# EAGLE design cblock-vrs (EAGLE 6.6.0)
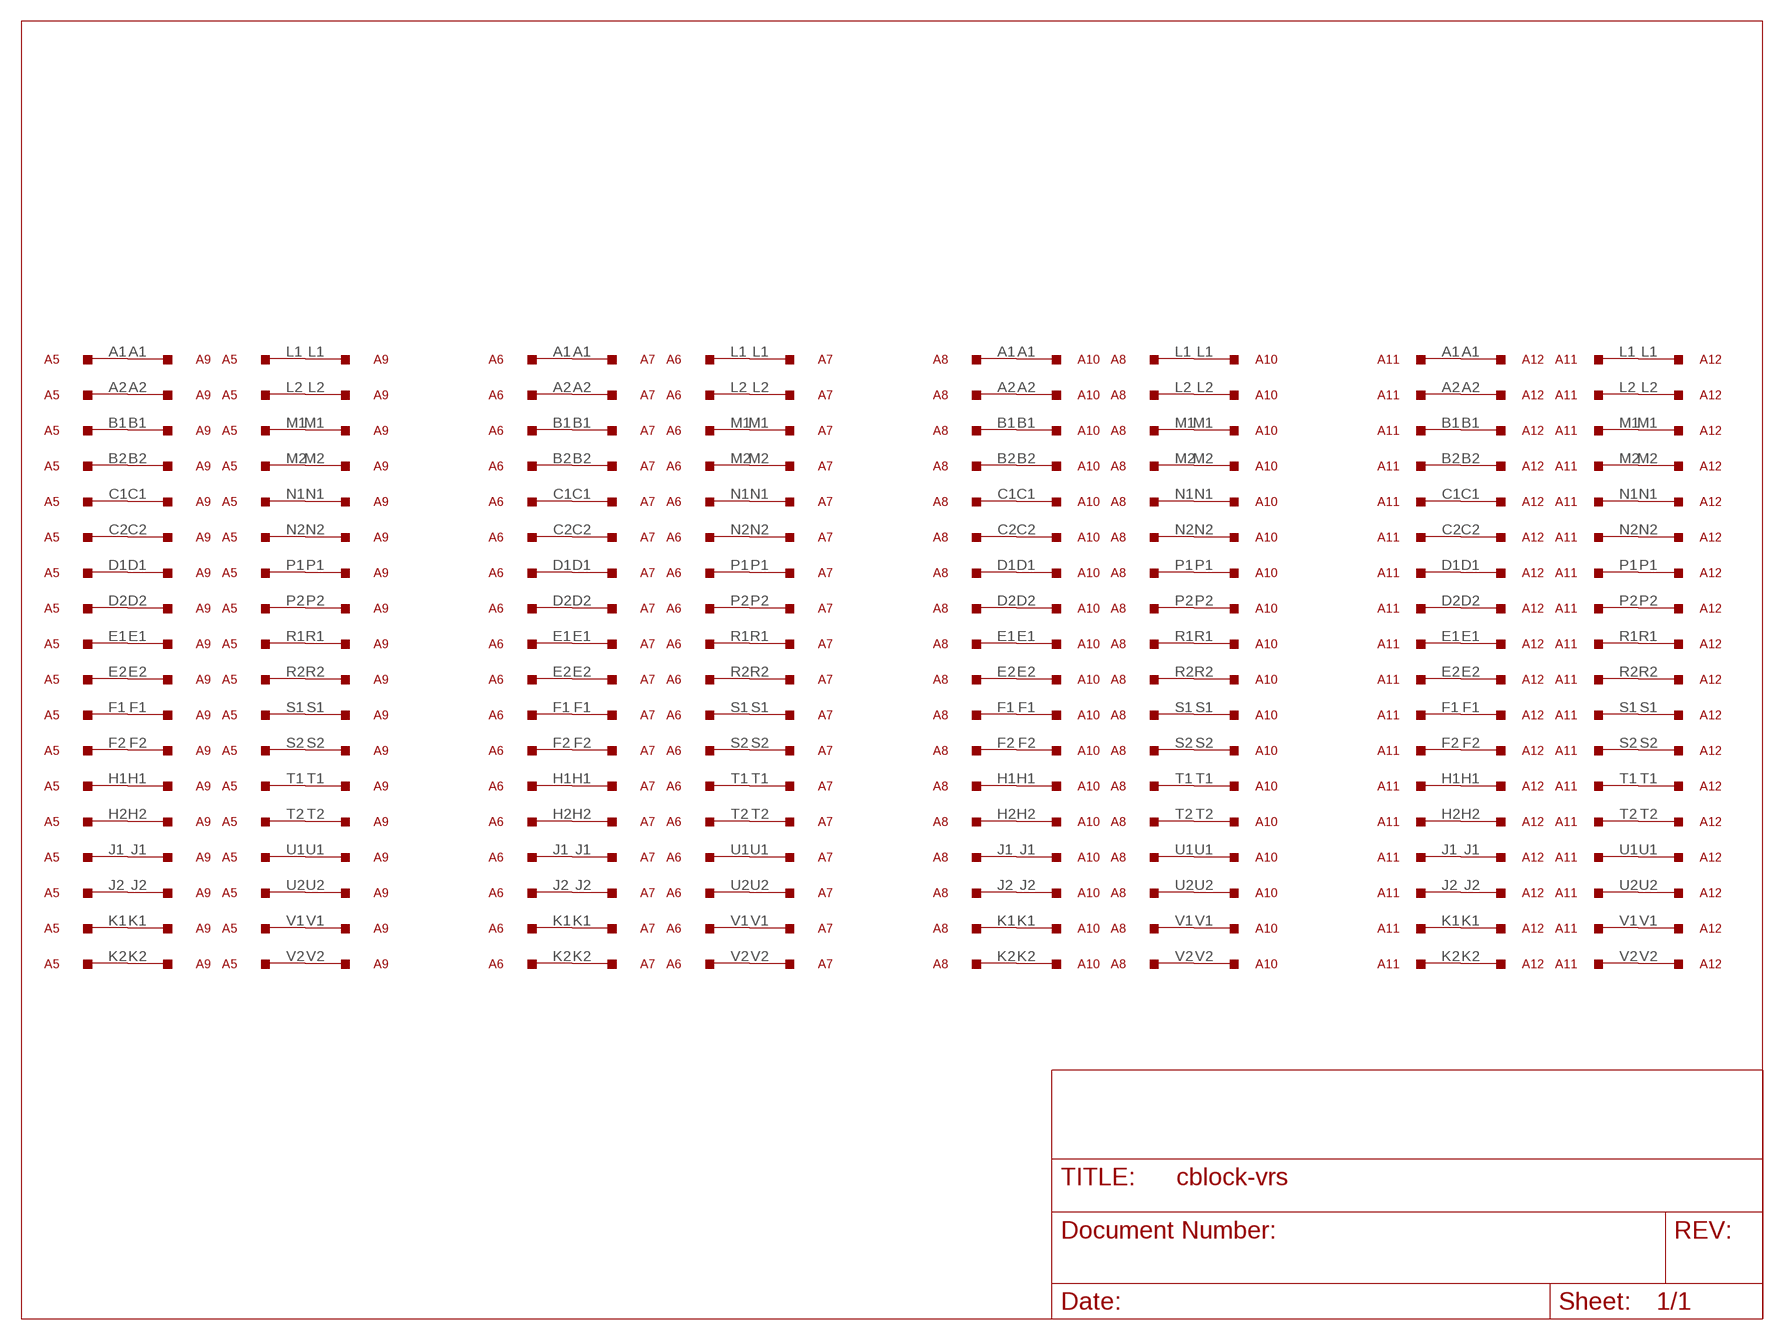
[diagram p0: schematic, sheet 1]

## Parts
A5  M916  [H807]
A6  M916  [H807]
A7  M916  [H807]
A8  M916  [H807]
A9  M916  [H807]
A10  M916  [H807]
A11  M916  [H807]
A12  M916  [H807]

## Nets
N$26: A5.L1 A9.L1
N$33: A5.L2 A9.L2
N$34: A5.M1 A9.M1
N$35: A5.M2 A9.M2
N$36: A5.N1 A9.N1
N$49: A5.N2 A9.N2
N$50: A5.P1 A9.P1
N$51: A5.P2 A9.P2
N$52: A5.R1 A9.R1
N$69: A5.R2 A9.R2
N$70: A5.S1 A9.S1
N$71: A5.S2 A9.S2
N$72: A5.T1 A9.T1
N$73: A5.T2 A9.T2
N$74: A5.U1 A9.U1
N$75: A5.U2 A9.U2
N$76: A5.V1 A9.V1
N$81: A5.V2 A9.V2
N$82: A5.A1 A9.A1
N$83: A5.A2 A9.A2
N$84: A5.B1 A9.B1
N$85: A5.B2 A9.B2
N$86: A5.C1 A9.C1
N$87: A5.C2 A9.C2
N$88: A5.D1 A9.D1
N$89: A5.D2 A9.D2
N$90: A5.E1 A9.E1
N$91: A5.E2 A9.E2
N$92: A5.F1 A9.F1
N$93: A5.F2 A9.F2
N$95: A5.H1 A9.H1
N$96: A5.H2 A9.H2
N$97: A5.J1 A9.J1
N$98: A5.J2 A9.J2
N$99: A5.K1 A9.K1
N$100: A5.K2 A9.K2
N$113: A6.L1 A7.L1
N$114: A6.L2 A7.L2
N$115: A6.M1 A7.M1
N$116: A6.M2 A7.M2
N$117: A6.N1 A7.N1
N$118: A6.N2 A7.N2
N$119: A6.P1 A7.P1
N$120: A6.P2 A7.P2
N$121: A6.R1 A7.R1
N$122: A6.R2 A7.R2
N$123: A6.S1 A7.S1
N$137: A6.S2 A7.S2
N$186: A6.T1 A7.T1
N$187: A6.T2 A7.T2
N$188: A6.U1 A7.U1
N$189: A6.U2 A7.U2
N$190: A6.V1 A7.V1
N$191: A6.V2 A7.V2
N$192: A6.A1 A7.A1
N$193: A6.A2 A7.A2
N$194: A6.B1 A7.B1
N$195: A6.B2 A7.B2
N$196: A6.C1 A7.C1
N$197: A6.C2 A7.C2
N$198: A6.D1 A7.D1
N$199: A6.D2 A7.D2
N$200: A6.E1 A7.E1
N$201: A6.E2 A7.E2
N$202: A6.F1 A7.F1
N$203: A6.F2 A7.F2
N$204: A6.H1 A7.H1
N$205: A6.H2 A7.H2
N$206: A6.J1 A7.J1
N$207: A6.J2 A7.J2
N$208: A6.K1 A7.K1
N$209: A6.K2 A7.K2
N$210: A8.L1 A10.L1
N$211: A8.L2 A10.L2
N$212: A8.M1 A10.M1
N$213: A8.M2 A10.M2
N$214: A8.N1 A10.N1
N$215: A8.N2 A10.N2
N$216: A8.P1 A10.P1
N$217: A8.P2 A10.P2
N$218: A8.R1 A10.R1
N$219: A8.R2 A10.R2
N$220: A8.S1 A10.S1
N$221: A8.S2 A10.S2
N$222: A8.T1 A10.T1
N$223: A8.T2 A10.T2
N$224: A8.U1 A10.U1
N$225: A8.U2 A10.U2
N$226: A8.V1 A10.V1
N$227: A8.V2 A10.V2
N$228: A8.A1 A10.A1
N$229: A8.A2 A10.A2
N$230: A8.B1 A10.B1
N$231: A8.B2 A10.B2
N$232: A8.C1 A10.C1
N$233: A8.C2 A10.C2
N$234: A8.D1 A10.D1
N$235: A8.D2 A10.D2
N$236: A8.E1 A10.E1
N$237: A8.E2 A10.E2
N$238: A8.F1 A10.F1
N$239: A8.F2 A10.F2
N$240: A8.H1 A10.H1
N$241: A8.H2 A10.H2
N$242: A8.J1 A10.J1
N$243: A8.J2 A10.J2
N$244: A8.K1 A10.K1
N$245: A8.K2 A10.K2
N$246: A11.L1 A12.L1
N$247: A11.L2 A12.L2
N$248: A11.M1 A12.M1
N$249: A11.M2 A12.M2
N$250: A11.N1 A12.N1
N$251: A11.N2 A12.N2
N$252: A11.P1 A12.P1
N$253: A11.P2 A12.P2
N$254: A11.R1 A12.R1
N$255: A11.R2 A12.R2
N$256: A11.S1 A12.S1
N$257: A11.S2 A12.S2
N$258: A11.T1 A12.T1
N$259: A11.T2 A12.T2
N$260: A11.U1 A12.U1
N$261: A11.U2 A12.U2
N$262: A11.V1 A12.V1
N$263: A11.V2 A12.V2
N$264: A11.A1 A12.A1
N$265: A11.A2 A12.A2
N$266: A11.B1 A12.B1
N$267: A11.B2 A12.B2
N$268: A11.C1 A12.C1
N$269: A11.C2 A12.C2
N$270: A11.D1 A12.D1
N$271: A11.D2 A12.D2
N$272: A11.E1 A12.E1
N$273: A11.E2 A12.E2
N$274: A11.F1 A12.F1
N$275: A11.F2 A12.F2
N$276: A11.H1 A12.H1
N$277: A11.H2 A12.H2
N$278: A11.J1 A12.J1
N$279: A11.J2 A12.J2
N$280: A11.K1 A12.K1
N$281: A11.K2 A12.K2

## Library data of the parts
A5-A12 = dec-m:M916: Simple 36 pin connector/wire cable

## Net classes
1 Power: width 0.305 mm, clearance 0.305 mm

## Board
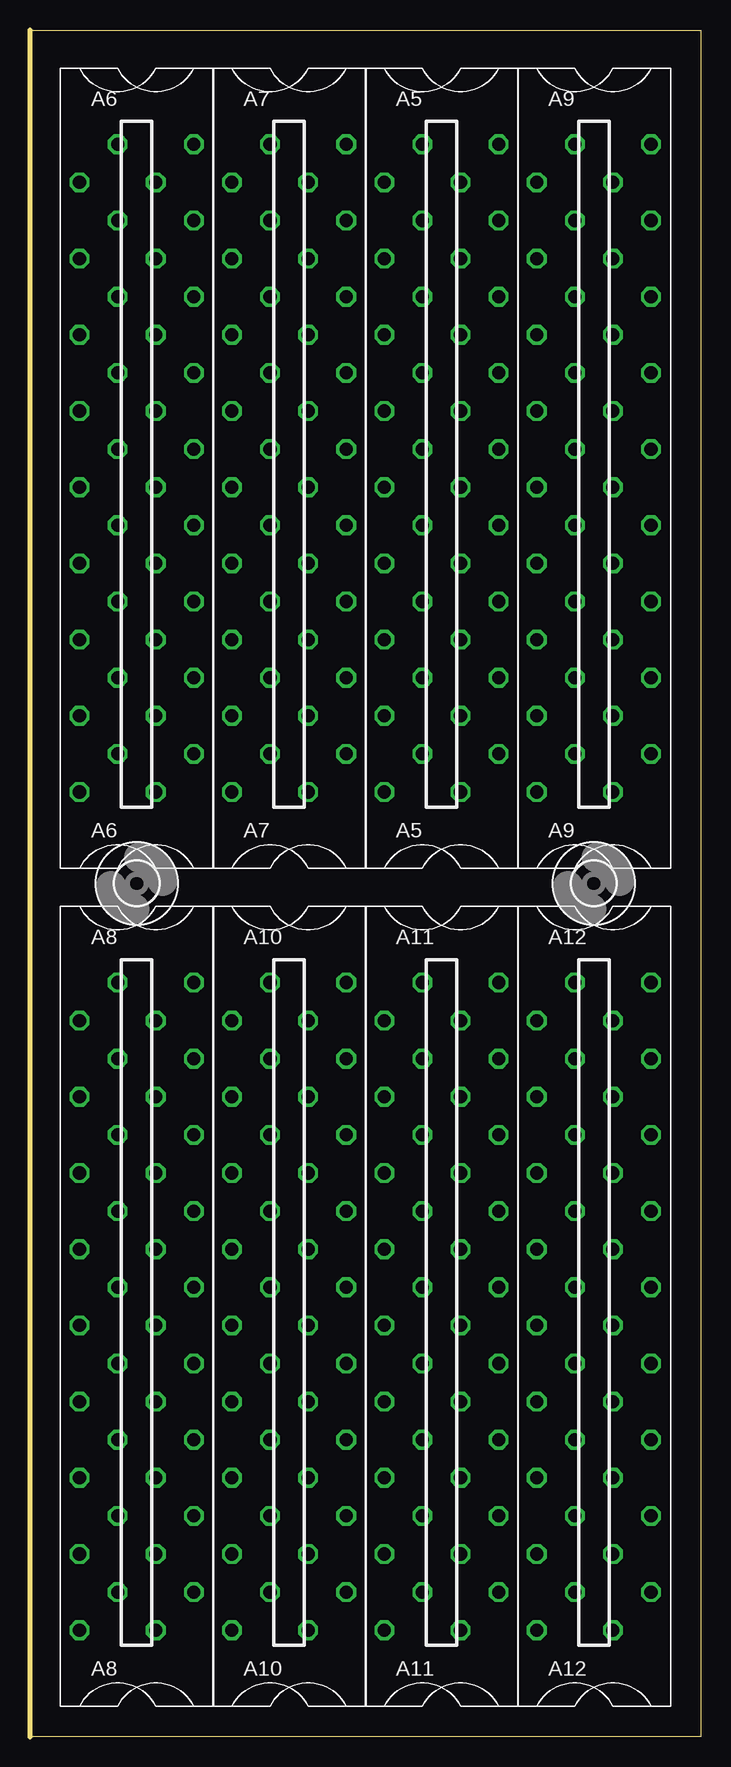
[diagram p1: board, top side]
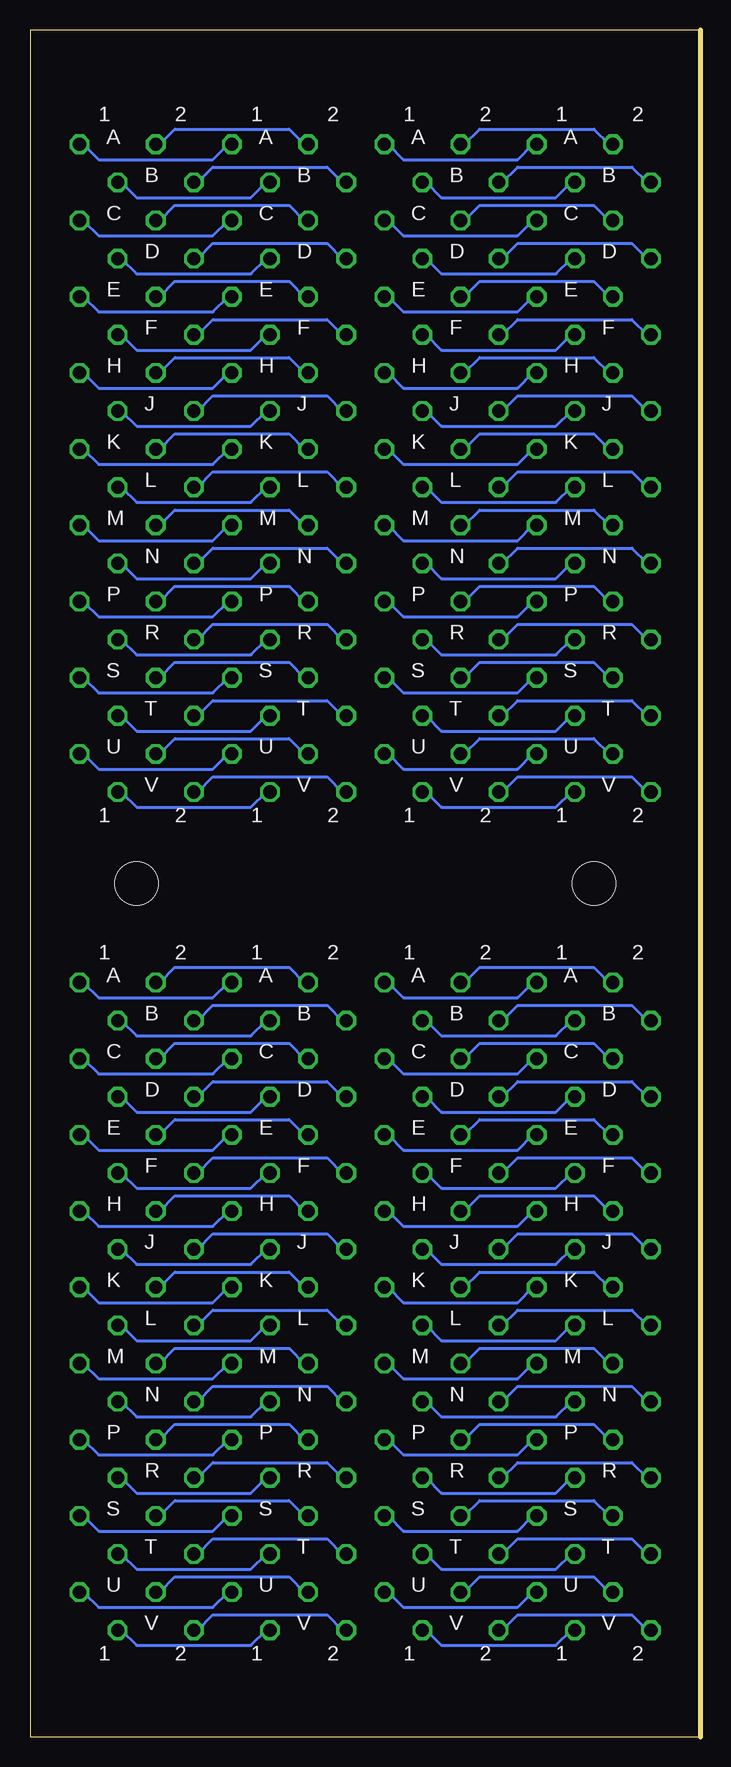
[diagram p2: board, bottom side, seen from below]

Size 55.88 x 142.24 mm. Coordinates in mm from the lower left corner, seen from the top.
Outline: 55.88,0 0,0 0,142.24 55.88,142.24 55.88,0
Copper layers (1*16): Top 0.035mm / dielectric 1.5mm / Bottom 0.035mm
Design rules "olimex10mil": minimum track width 10mil, minimum drill 24mil, track to track 10mil, track to pad 10mil, pad to pad 10mil, via to via 10mil, smd to smd 10mil, copper to edge 40mil, drill to drill 10mil, minimum pad ring 10mil, minimum via ring 8mil, stop-mask expansion 0mil, vias tented up to drill 0mil, thermal gap 10mil

### Footprints (pad centres in the part's own frame; a part is rotated, then mirrored left to right if it is on the bottom)
H807 = drill 1.092 octagon: A1 4.763,28.575; A2 -1.587,28.575; B1 1.587,25.4; B2 -4.763,25.4; C1 4.763,22.225; C2 -1.587,22.225; D1 1.587,19.05; D2 -4.763,19.05; E1 4.763,15.875; E2 -1.587,15.875; F1 1.587,12.7; F2 -4.763,12.7; H1 4.763,9.525; H2 -1.587,9.525; J1 1.587,6.35; J2 -4.763,6.35; K1 4.763,3.175; K2 -1.587,3.175; L1 1.587,0; L2 -4.763,0; M1 4.763,-3.175; M2 -1.587,-3.175; N1 1.587,-6.35; N2 -4.763,-6.35; P1 4.763,-9.525; P2 -1.587,-9.525; R1 1.587,-12.7; R2 -4.763,-12.7; S1 4.763,-15.875; S2 -1.587,-15.875; T1 1.587,-19.05; T2 -4.763,-19.05; U1 4.763,-22.225; U2 -1.587,-22.225; V1 1.587,-25.4; V2 -4.763,-25.4
3,6 = hole 3.6: 0,0

### Placement (x,y rotation side)
A5  34.29,104.14 0 top
A6  8.89,104.14 0 top
A7  21.59,104.14 0 top
A8  8.89,34.29 0 top
A9  46.99,104.14 0 top
A10  21.59,34.29 0 top
A11  34.29,34.29 0 top
A12  46.99,34.29 0 top
U$5  [3,6]  8.89,71.12 0 top
U$6  [3,6]  46.99,71.12 0 top

### Tracks (layer width: path | path; a pad name or v marks a point on that pad's centre or on a via)
N$26
  Bottom 0.254: A5.L1 36.2,104.14 37.47,102.87 46.99,102.87 48.26,104.14 A9.L1
N$33
  Bottom 0.254: A5.L2 29.84,104.14 31.11,105.41 40.64,105.41 41.91,104.14 A9.L2
N$34
  Bottom 0.254: A5.M1 39.37,100.97 40.64,99.69 50.16,99.69 51.44,100.97 A9.M1
N$35
  Bottom 0.254: A5.M2 33.02,100.97 34.29,102.23 43.81,102.23 45.09,100.97 A9.M2
N$36
  Bottom 0.254: A5.N1 36.2,97.79 37.47,96.52 46.99,96.52 48.26,97.79 A9.N1
N$49
  Bottom 0.254: A5.N2 29.84,97.79 31.11,99.06 40.64,99.06 41.91,97.79 A9.N2
N$50
  Bottom 0.254: A5.P1 39.37,94.61 40.64,93.34 50.16,93.34 51.44,94.61 A9.P1
N$51
  Bottom 0.254: A5.P2 33.02,94.61 34.29,95.89 43.81,95.89 45.09,94.61 A9.P2
N$52
  Bottom 0.254: A5.R1 36.2,91.44 37.47,90.17 46.99,90.17 48.26,91.44 A9.R1
N$69
  Bottom 0.254: A5.R2 29.84,91.44 31.11,92.71 40.64,92.71 41.91,91.44 A9.R2
N$70
  Bottom 0.254: A5.S1 39.37,88.27 40.64,87 50.16,87 51.44,88.27 A9.S1
N$71
  Bottom 0.254: A5.S2 33.02,88.27 34.29,89.53 43.81,89.53 45.09,88.27 A9.S2
N$72
  Bottom 0.254: A5.T1 36.2,85.09 37.47,83.82 46.99,83.82 48.26,85.09 A9.T1
N$73
  Bottom 0.254: A5.T2 29.84,85.09 31.11,86.36 40.64,86.36 41.91,85.09 A9.T2
N$74
  Bottom 0.254: A5.U1 39.37,81.92 40.64,80.64 50.16,80.64 51.44,81.92 A9.U1
N$75
  Bottom 0.254: A5.U2 33.02,81.92 34.29,83.19 43.81,83.19 45.09,81.92 A9.U2
N$76
  Bottom 0.254: A5.V1 36.2,78.74 37.47,77.47 46.99,77.47 48.26,78.74 A9.V1
N$81
  Bottom 0.254: A5.V2 29.84,78.74 31.11,80.01 40.64,80.01 41.91,78.74 A9.V2
N$82
  Bottom 0.254: A5.A1 39.37,132.72 40.64,131.44 50.16,131.44 51.44,132.72 A9.A1
N$83
  Bottom 0.254: A5.A2 33.02,132.72 34.29,133.99 43.81,133.99 45.09,132.72 A9.A2
N$84
  Bottom 0.254: A5.B1 36.2,129.54 37.47,128.27 46.99,128.27 48.26,129.54 A9.B1
N$85
  Bottom 0.254: A5.B2 29.84,129.54 31.11,130.81 40.64,130.81 41.91,129.54 A9.B2
N$86
  Bottom 0.254: A5.C1 39.37,126.36 40.64,125.09 50.16,125.09 51.44,126.36 A9.C1
N$87
  Bottom 0.254: A5.C2 33.02,126.36 34.29,127.64 43.81,127.64 45.09,126.36 A9.C2
N$88
  Bottom 0.254: A5.D1 36.2,123.19 37.47,121.92 46.99,121.92 48.26,123.19 A9.D1
N$89
  Bottom 0.254: A5.D2 29.84,123.19 31.11,124.46 40.64,124.46 41.91,123.19 A9.D2
N$90
  Bottom 0.254: A5.E1 39.37,120.02 40.64,118.75 50.16,118.75 51.44,120.02 A9.E1
N$91
  Bottom 0.254: A5.E2 33.02,120.02 34.29,121.28 43.81,121.28 45.09,120.02 A9.E2
N$92
  Bottom 0.254: A5.F1 36.2,116.84 37.47,115.57 46.99,115.57 48.26,116.84 A9.F1
N$93
  Bottom 0.254: A5.F2 29.84,116.84 31.11,118.11 40.64,118.11 41.91,116.84 A9.F2
N$95
  Bottom 0.254: A5.H1 39.37,113.67 40.64,112.39 50.16,112.39 51.44,113.67 A9.H1
N$96
  Bottom 0.254: A5.H2 33.02,113.67 34.29,114.94 43.81,114.94 45.09,113.67 A9.H2
N$97
  Bottom 0.254: A5.J1 36.2,110.49 37.47,109.22 46.99,109.22 48.26,110.49 A9.J1
N$98
  Bottom 0.254: A5.J2 29.84,110.49 31.11,111.76 40.64,111.76 41.91,110.49 A9.J2
N$99
  Bottom 0.254: A5.K1 39.37,107.31 40.64,106.05 50.16,106.05 51.44,107.31 A9.K1
N$100
  Bottom 0.254: A5.K2 33.02,107.31 34.29,108.58 43.81,108.58 45.09,107.31 A9.K2
N$113
  Bottom 0.254: A6.L1 10.79,104.14 12.06,102.87 21.59,102.87 22.86,104.14 A7.L1
N$114
  Bottom 0.254: A6.L2 4.45,104.14 5.71,105.41 15.24,105.41 16.51,104.14 A7.L2
N$115
  Bottom 0.254: A6.M1 13.97,100.97 15.24,99.69 24.77,99.69 26.04,100.97 A7.M1
N$116
  Bottom 0.254: A6.M2 7.62,100.97 8.89,102.23 18.41,102.23 19.68,100.97 A7.M2
N$117
  Bottom 0.254: A6.N1 10.79,97.79 12.06,96.52 21.59,96.52 22.86,97.79 A7.N1
N$118
  Bottom 0.254: A6.N2 4.45,97.79 5.71,99.06 15.24,99.06 16.51,97.79 A7.N2
N$119
  Bottom 0.254: A6.P1 13.97,94.61 15.24,93.34 24.77,93.34 26.04,94.61 A7.P1
N$120
  Bottom 0.254: A6.P2 7.62,94.61 8.89,95.89 18.41,95.89 19.68,94.61 A7.P2
N$121
  Bottom 0.254: A6.R1 10.79,91.44 12.06,90.17 21.59,90.17 22.86,91.44 A7.R1
N$122
  Bottom 0.254: A6.R2 4.45,91.44 5.71,92.71 15.24,92.71 16.51,91.44 A7.R2
N$123
  Bottom 0.254: A6.S1 13.97,88.27 15.24,87 24.77,87 26.04,88.27 A7.S1
N$137
  Bottom 0.254: A6.S2 7.62,88.27 8.89,89.53 18.41,89.53 19.68,88.27 A7.S2
N$186
  Bottom 0.254: A6.T1 10.79,85.09 12.06,83.82 21.59,83.82 22.86,85.09 A7.T1
N$187
  Bottom 0.254: A6.T2 4.45,85.09 5.71,86.36 15.24,86.36 16.51,85.09 A7.T2
N$188
  Bottom 0.254: A6.U1 13.97,81.92 15.24,80.64 24.77,80.64 26.04,81.92 A7.U1
N$189
  Bottom 0.254: A6.U2 7.62,81.92 8.89,83.19 18.41,83.19 19.68,81.92 A7.U2
N$190
  Bottom 0.254: A6.V1 10.79,78.74 12.06,77.47 21.59,77.47 22.86,78.74 A7.V1
N$191
  Bottom 0.254: A6.V2 4.45,78.74 5.71,80.01 15.24,80.01 16.51,78.74 A7.V2
N$192
  Bottom 0.254: A6.A1 13.97,132.72 15.24,131.44 24.77,131.44 26.04,132.72 A7.A1
N$193
  Bottom 0.254: A6.A2 7.62,132.72 8.89,133.99 18.41,133.99 19.68,132.72 A7.A2
N$194
  Bottom 0.254: A6.B1 10.79,129.54 12.06,128.27 21.59,128.27 22.86,129.54 A7.B1
N$195
  Bottom 0.254: A6.B2 4.45,129.54 5.71,130.81 15.24,130.81 16.51,129.54 A7.B2
N$196
  Bottom 0.254: A6.C1 13.97,126.36 15.24,125.09 24.77,125.09 26.04,126.36 A7.C1
N$197
  Bottom 0.254: A6.C2 7.62,126.36 8.89,127.64 18.41,127.64 19.68,126.36 A7.C2
N$198
  Bottom 0.254: A6.D1 10.79,123.19 12.06,121.92 21.59,121.92 22.86,123.19 A7.D1
N$199
  Bottom 0.254: A6.D2 4.45,123.19 5.71,124.46 15.24,124.46 16.51,123.19 A7.D2
N$200
  Bottom 0.254: A6.E1 13.97,120.02 15.24,118.75 24.77,118.75 26.04,120.02 A7.E1
N$201
  Bottom 0.254: A6.E2 7.62,120.02 8.89,121.28 18.41,121.28 19.68,120.02 A7.E2
N$202
  Bottom 0.254: A6.F1 10.79,116.84 12.06,115.57 21.59,115.57 22.86,116.84 A7.F1
N$203
  Bottom 0.254: A6.F2 4.45,116.84 5.71,118.11 15.24,118.11 16.51,116.84 A7.F2
N$204
  Bottom 0.254: A6.H1 13.97,113.67 15.24,112.39 24.77,112.39 26.04,113.67 A7.H1
N$205
  Bottom 0.254: A6.H2 7.62,113.67 8.89,114.94 18.41,114.94 19.68,113.67 A7.H2
N$206
  Bottom 0.254: A6.J1 10.79,110.49 12.06,109.22 21.59,109.22 22.86,110.49 A7.J1
N$207
  Bottom 0.254: A6.J2 4.45,110.49 5.71,111.76 15.24,111.76 16.51,110.49 A7.J2
N$208
  Bottom 0.254: A6.K1 13.97,107.31 15.24,106.05 24.77,106.05 26.04,107.31 A7.K1
N$209
  Bottom 0.254: A6.K2 7.62,107.31 8.89,108.58 18.41,108.58 19.68,107.31 A7.K2
N$210
  Bottom 0.254: A8.L1 10.79,34.29 12.06,33.02 21.59,33.02 22.86,34.29 A10.L1
N$211
  Bottom 0.254: A8.L2 4.45,34.29 5.71,35.56 15.24,35.56 16.51,34.29 A10.L2
N$212
  Bottom 0.254: A8.M1 13.97,31.11 15.24,29.84 24.77,29.84 26.04,31.11 A10.M1
N$213
  Bottom 0.254: A8.M2 7.62,31.11 8.89,32.38 18.41,32.38 19.68,31.11 A10.M2
N$214
  Bottom 0.254: A8.N1 10.79,27.94 12.06,26.67 21.59,26.67 22.86,27.94 A10.N1
N$215
  Bottom 0.254: A8.N2 4.45,27.94 5.71,29.21 15.24,29.21 16.51,27.94 A10.N2
N$216
  Bottom 0.254: A8.P1 13.97,24.77 15.24,23.5 24.77,23.5 26.04,24.77 A10.P1
N$217
  Bottom 0.254: A8.P2 7.62,24.77 8.89,26.04 18.41,26.04 19.68,24.77 A10.P2
N$218
  Bottom 0.254: A8.R1 10.79,21.59 12.06,20.32 21.59,20.32 22.86,21.59 A10.R1
N$219
  Bottom 0.254: A8.R2 4.45,21.59 5.71,22.86 15.24,22.86 16.51,21.59 A10.R2
N$220
  Bottom 0.254: A8.S1 13.97,18.41 15.24,17.14 24.77,17.14 26.04,18.41 A10.S1
N$221
  Bottom 0.254: A8.S2 7.62,18.41 8.89,19.68 18.41,19.68 19.68,18.41 A10.S2
N$222
  Bottom 0.254: A8.T1 10.79,15.24 12.06,13.97 21.59,13.97 22.86,15.24 A10.T1
N$223
  Bottom 0.254: A8.T2 4.45,15.24 5.71,16.51 15.24,16.51 16.51,15.24 A10.T2
N$224
  Bottom 0.254: A8.U1 13.97,12.06 15.24,10.79 24.77,10.79 26.04,12.06 A10.U1
N$225
  Bottom 0.254: A8.U2 7.62,12.06 8.89,13.34 18.41,13.34 19.68,12.06 A10.U2
N$226
  Bottom 0.254: A8.V1 10.79,8.89 12.06,7.62 21.59,7.62 22.86,8.89 A10.V1
N$227
  Bottom 0.254: A8.V2 4.45,8.89 5.71,10.16 15.24,10.16 16.51,8.89 A10.V2
N$228
  Bottom 0.254: A8.A1 13.97,62.87 15.24,61.59 24.77,61.59 26.04,62.87 A10.A1
N$229
  Bottom 0.254: A8.A2 7.62,62.87 8.89,64.14 18.41,64.14 19.68,62.87 A10.A2
N$230
  Bottom 0.254: A8.B1 10.79,59.69 12.06,58.42 21.59,58.42 22.86,59.69 A10.B1
N$231
  Bottom 0.254: A8.B2 4.45,59.69 5.71,60.96 15.24,60.96 16.51,59.69 A10.B2
N$232
  Bottom 0.254: A8.C1 13.97,56.52 15.24,55.24 24.77,55.24 26.04,56.52 A10.C1
N$233
  Bottom 0.254: A8.C2 7.62,56.52 8.89,57.78 18.41,57.78 19.68,56.52 A10.C2
N$234
  Bottom 0.254: A8.D1 10.79,53.34 12.06,52.07 21.59,52.07 22.86,53.34 A10.D1
N$235
  Bottom 0.254: A8.D2 4.45,53.34 5.71,54.61 15.24,54.61 16.51,53.34 A10.D2
N$236
  Bottom 0.254: A8.E1 13.97,50.16 15.24,48.9 24.77,48.9 26.04,50.16 A10.E1
N$237
  Bottom 0.254: A8.E2 7.62,50.16 8.89,51.44 18.41,51.44 19.68,50.16 A10.E2
N$238
  Bottom 0.254: A8.F1 10.79,46.99 12.06,45.72 21.59,45.72 22.86,46.99 A10.F1
N$239
  Bottom 0.254: A8.F2 4.45,46.99 5.71,48.26 15.24,48.26 16.51,46.99 A10.F2
N$240
  Bottom 0.254: A8.H1 13.97,43.81 15.24,42.55 24.77,42.55 26.04,43.81 A10.H1
N$241
  Bottom 0.254: A8.H2 7.62,43.81 8.89,45.09 18.41,45.09 19.68,43.81 A10.H2
N$242
  Bottom 0.254: A8.J1 10.79,40.64 12.06,39.37 21.59,39.37 22.86,40.64 A10.J1
N$243
  Bottom 0.254: A8.J2 4.45,40.64 5.71,41.91 15.24,41.91 16.51,40.64 A10.J2
N$244
  Bottom 0.254: A8.K1 13.97,37.47 15.24,36.2 24.77,36.2 26.04,37.47 A10.K1
N$245
  Bottom 0.254: A8.K2 7.62,37.47 8.89,38.73 18.41,38.73 19.68,37.47 A10.K2
N$246
  Bottom 0.254: A11.L1 36.2,34.29 37.47,33.02 46.99,33.02 48.26,34.29 A12.L1
N$247
  Bottom 0.254: A11.L2 29.84,34.29 31.11,35.56 40.64,35.56 41.91,34.29 A12.L2
N$248
  Bottom 0.254: A11.M1 39.37,31.11 40.64,29.84 50.16,29.84 51.44,31.11 A12.M1
N$249
  Bottom 0.254: A11.M2 33.02,31.11 34.29,32.38 43.81,32.38 45.09,31.11 A12.M2
N$250
  Bottom 0.254: A11.N1 36.2,27.94 37.47,26.67 46.99,26.67 48.26,27.94 A12.N1
N$251
  Bottom 0.254: A11.N2 29.84,27.94 31.11,29.21 40.64,29.21 41.91,27.94 A12.N2
N$252
  Bottom 0.254: A11.P1 39.37,24.77 40.64,23.5 50.16,23.5 51.44,24.77 A12.P1
N$253
  Bottom 0.254: A11.P2 33.02,24.77 34.29,26.04 43.81,26.04 45.09,24.77 A12.P2
N$254
  Bottom 0.254: A11.R1 36.2,21.59 37.47,20.32 46.99,20.32 48.26,21.59 A12.R1
N$255
  Bottom 0.254: A11.R2 29.84,21.59 31.11,22.86 40.64,22.86 41.91,21.59 A12.R2
N$256
  Bottom 0.254: A11.S1 39.37,18.41 40.64,17.14 50.16,17.14 51.44,18.41 A12.S1
N$257
  Bottom 0.254: A11.S2 33.02,18.41 34.29,19.68 43.81,19.68 45.09,18.41 A12.S2
N$258
  Bottom 0.254: A11.T1 36.2,15.24 37.47,13.97 46.99,13.97 48.26,15.24 A12.T1
N$259
  Bottom 0.254: A11.T2 29.84,15.24 31.11,16.51 40.64,16.51 41.91,15.24 A12.T2
N$260
  Bottom 0.254: A11.U1 39.37,12.06 40.64,10.79 50.16,10.79 51.44,12.06 A12.U1
N$261
  Bottom 0.254: A11.U2 33.02,12.06 34.29,13.34 43.81,13.34 45.09,12.06 A12.U2
N$262
  Bottom 0.254: A11.V1 36.2,8.89 37.47,7.62 46.99,7.62 48.26,8.89 A12.V1
N$263
  Bottom 0.254: A11.V2 29.84,8.89 31.11,10.16 40.64,10.16 41.91,8.89 A12.V2
N$264
  Bottom 0.254: A11.A1 39.37,62.87 40.64,61.59 50.16,61.59 51.44,62.87 A12.A1
N$265
  Bottom 0.254: A11.A2 33.02,62.87 34.29,64.14 43.81,64.14 45.09,62.87 A12.A2
N$266
  Bottom 0.254: A11.B1 36.2,59.69 37.47,58.42 46.99,58.42 48.26,59.69 A12.B1
N$267
  Bottom 0.254: A11.B2 29.84,59.69 31.11,60.96 40.64,60.96 41.91,59.69 A12.B2
N$268
  Bottom 0.254: A11.C1 39.37,56.52 40.64,55.24 50.16,55.24 51.44,56.52 A12.C1
N$269
  Bottom 0.254: A11.C2 33.02,56.52 34.29,57.78 43.81,57.78 45.09,56.52 A12.C2
N$270
  Bottom 0.254: A11.D1 36.2,53.34 37.47,52.07 46.99,52.07 48.26,53.34 A12.D1
N$271
  Bottom 0.254: A11.D2 29.84,53.34 31.11,54.61 40.64,54.61 41.91,53.34 A12.D2
N$272
  Bottom 0.254: A11.E1 39.37,50.16 40.64,48.9 50.16,48.9 51.44,50.16 A12.E1
N$273
  Bottom 0.254: A11.E2 33.02,50.16 34.29,51.44 43.81,51.44 45.09,50.16 A12.E2
N$274
  Bottom 0.254: A11.F1 36.2,46.99 37.47,45.72 46.99,45.72 48.26,46.99 A12.F1
N$275
  Bottom 0.254: A11.F2 29.84,46.99 31.11,48.26 40.64,48.26 41.91,46.99 A12.F2
N$276
  Bottom 0.254: A11.H1 39.37,43.81 40.64,42.55 50.16,42.55 51.44,43.81 A12.H1
N$277
  Bottom 0.254: A11.H2 33.02,43.81 34.29,45.09 43.81,45.09 45.09,43.81 A12.H2
N$278
  Bottom 0.254: A11.J1 36.2,40.64 37.47,39.37 46.99,39.37 48.26,40.64 A12.J1
N$279
  Bottom 0.254: A11.J2 29.84,40.64 31.11,41.91 40.64,41.91 41.91,40.64 A12.J2
N$280
  Bottom 0.254: A11.K1 39.37,37.47 40.64,36.2 50.16,36.2 51.44,37.47 A12.K1
N$281
  Bottom 0.254: A11.K2 33.02,37.47 34.29,38.73 43.81,38.73 45.09,37.47 A12.K2